# Altium project Fuente.V01.R00.PrjPcb
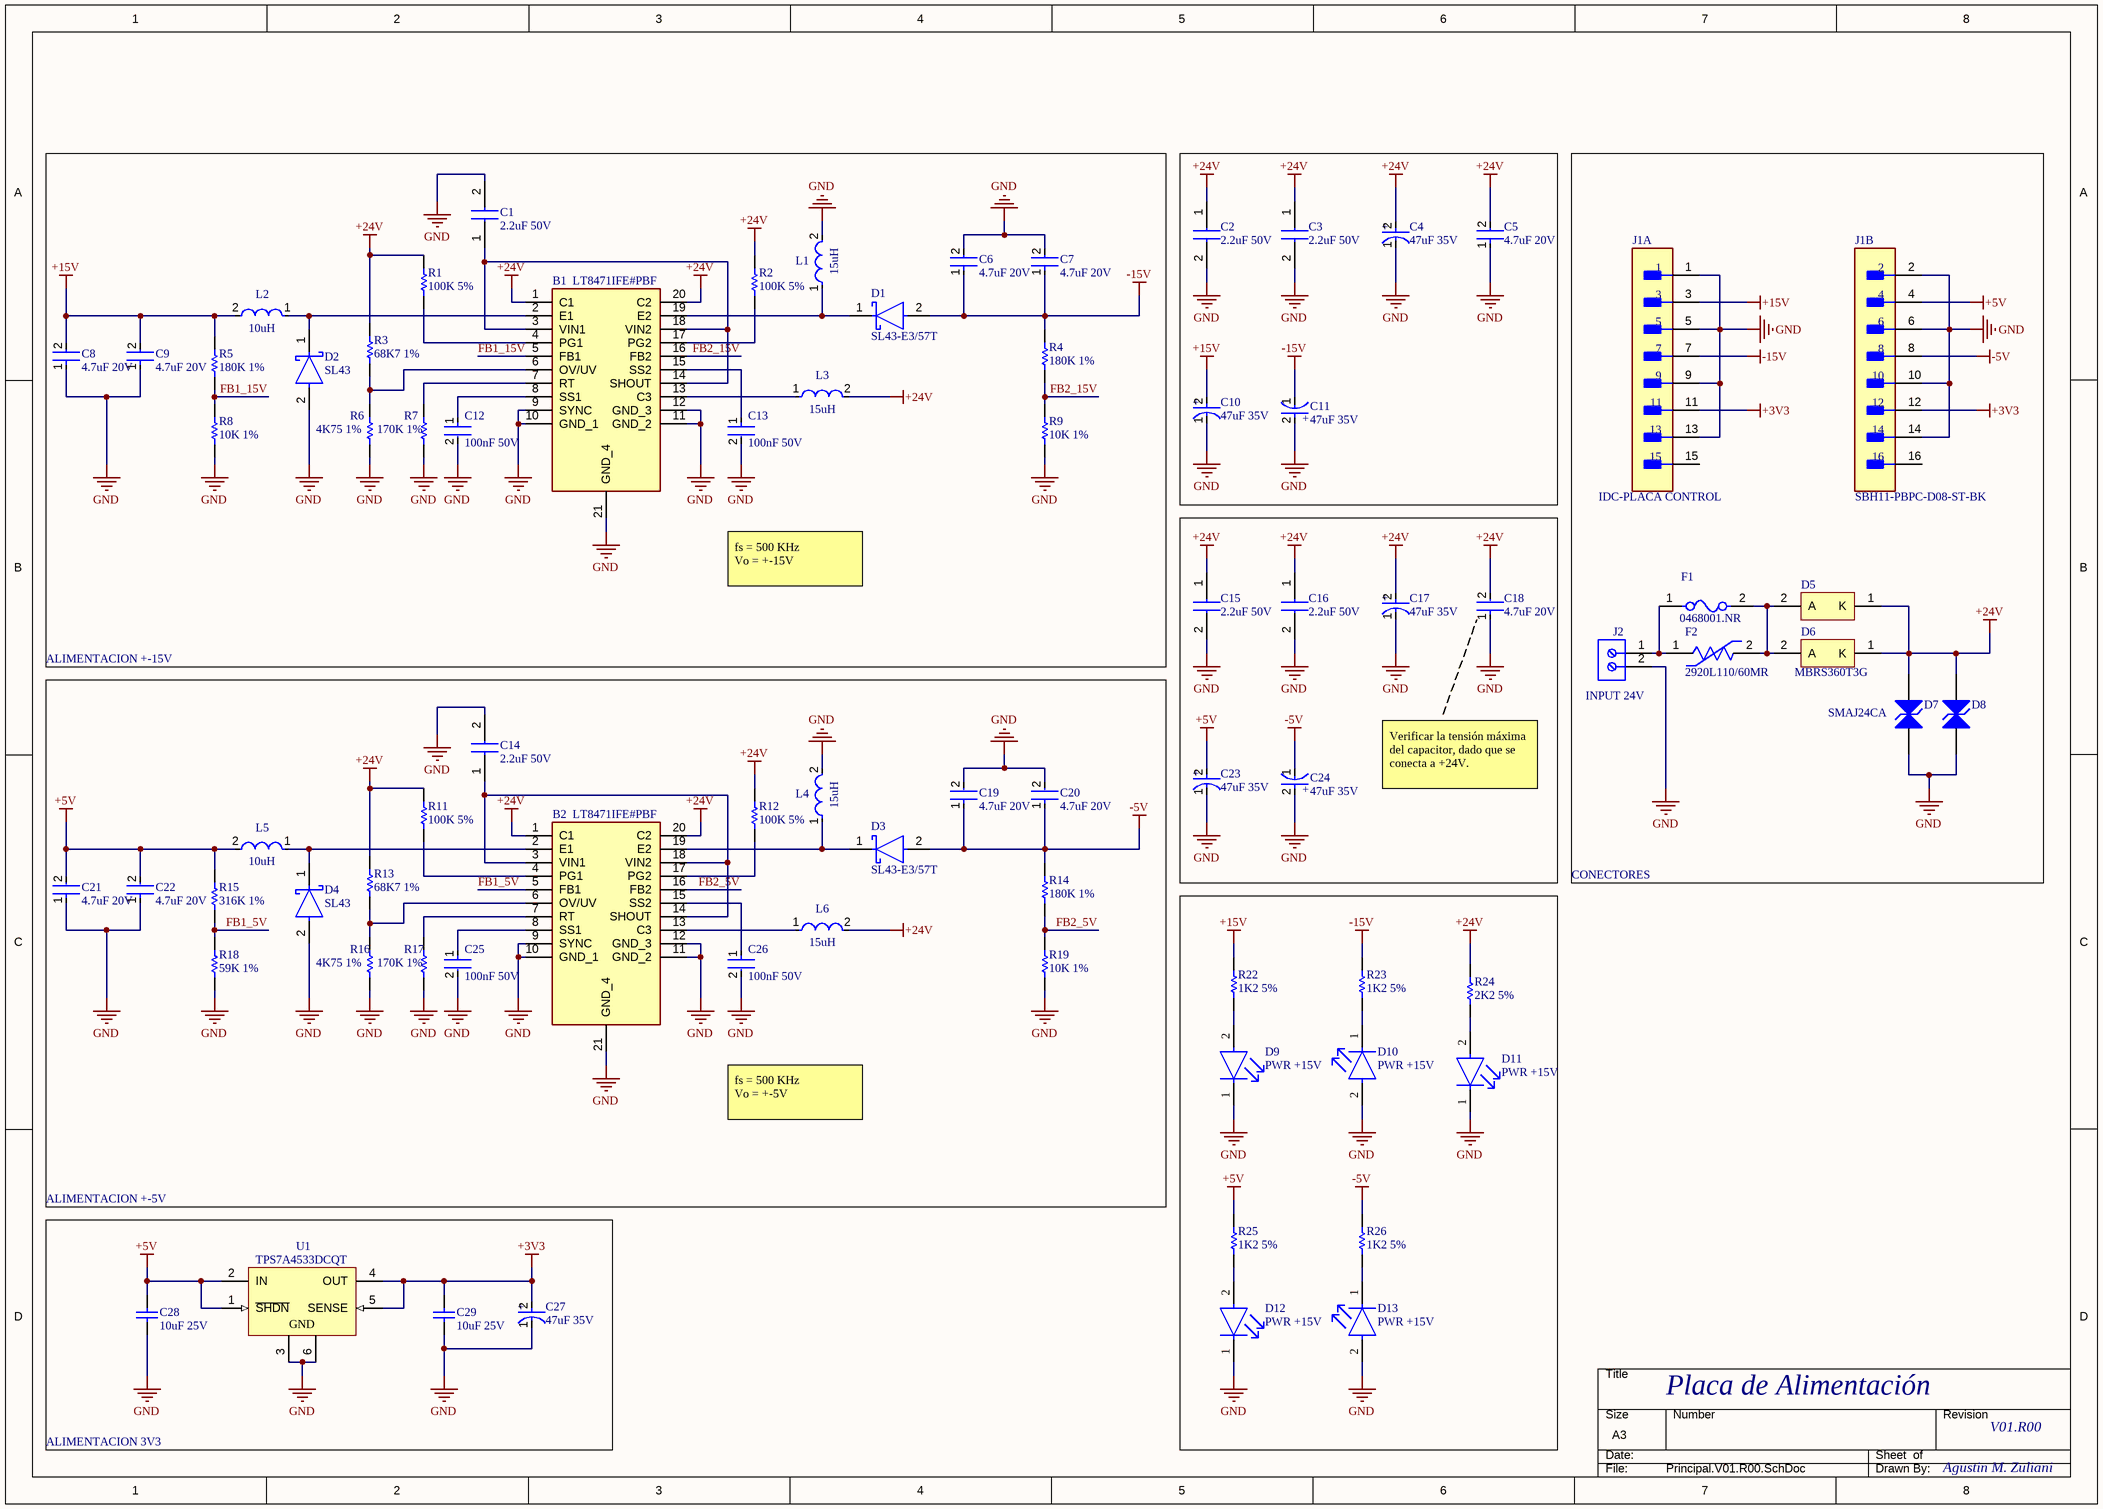
[diagram p0: Principal.V01.R00.SchDoc]
$(Librerias): D:\aguat\Documents\GitHub\AWG-RP2040\PCB\PCB_Fuente\Libreria-MouserElectronics
1 sheet, 78 parts. Net scope: global (net labels, ports and power ports of the same name join across sheets).
Board file: PCB-Fuente.V01.R00.PcbDoc

## Sheet Principal.V01.R00.SchDoc: Placa de Alimentación
size A3; Author: Agustin M. Zuliani; DrawnBy: Agustin M. Zuliani; Revision: V01.R00; SheetNumber: 1; SheetTotal: 1

### Parts
B1  LT8471IFE#PBF  [SOP65P640X120-21N]
B2  LT8471IFE#PBF  [SOP65P640X120-21N]
C1  2.2uF 50V  [MBASx31x]
C2  2.2uF 50V  [MBASx31x]
C3  2.2uF 50V  [MBASx31x]
C4  47uF 35V  [FP-FK-D-MFG]
C5  4.7uF 20V  [FP-CC1206-1_25-MFG]
C6  4.7uF 20V  [FP-CC1206-1_25-MFG]
C7  4.7uF 20V  [FP-CC1206-1_25-MFG]
C8  4.7uF 20V  [FP-CC1206-1_25-MFG]
C9  4.7uF 20V  [FP-CC1206-1_25-MFG]
C10  47uF 35V  [FP-FK-D-MFG]
C11  47uF 35V  [FP-FK-D-MFG]
C12  100nF 50V  [FP-C1206C-EB-MFG]
C13  100nF 50V  [FP-C1206C-EB-MFG]
C14  2.2uF 50V  [MBASx31x]
C15  2.2uF 50V  [MBASx31x]
C16  2.2uF 50V  [MBASx31x]
C17  47uF 35V  [FP-FK-D-MFG]
C18  4.7uF 20V  [FP-CC1206-1_25-MFG]
C19  4.7uF 20V  [FP-CC1206-1_25-MFG]
C20  4.7uF 20V  [FP-CC1206-1_25-MFG]
C21  4.7uF 20V  [FP-CC1206-1_25-MFG]
C22  4.7uF 20V  [FP-CC1206-1_25-MFG]
C23  47uF 35V  [FP-FK-D-MFG]
C24  47uF 35V  [FP-FK-D-MFG]
C25  100nF 50V  [FP-C1206C-EB-MFG]
C26  100nF 50V  [FP-C1206C-EB-MFG]
C27  47uF 35V  [FP-FK-D-MFG]
C28  10uF 25V  [CAPC1812(4532)280_L]
C29  10uF 25V  [CAPC1812(4532)280_L]
D1  SL43-E3/57T  [FP-95402-MFG]
D2  SL43  [FP-95402-MFG]
D3  SL43-E3/57T  [FP-95402-MFG]
D4  SL43  [FP-95402-MFG]
D5  MBRS360T3G  [ONSC-SMC-2-403-03_V]  (value not drawn)
D6  MBRS360T3G  [ONSC-SMC-2-403-03_V]
D7  SMAJ24CA  [VISH-DO-214AC-2_N]  (value not drawn)
D8  SMAJ24CA  [VISH-DO-214AC-2_N]
D9  PWR +15V  [FP-SML-LX0805UWC-TR-MFG]
D10  PWR +15V  [FP-SML-LX0805UWC-TR-MFG]
D11  PWR +15V  [FP-SML-LX0805UWC-TR-MFG]
D12  PWR +15V  [FP-SML-LX0805UWC-TR-MFG]
D13  PWR +15V  [FP-SML-LX0805UWC-TR-MFG]
F1  0468001.NR  [FP-0468-MFG]
F2  2920L110/60MR  [FP-2920L-MFG]
J1  IDC-PLACA CONTROL  [FP-SBH11-PBPC-D08-ST-BK-MFG]  (parts A,B of 2)
J2  INPUT 24V  [691111710002]
L1  15uH  [FP-NR6045-MFG]
L2  10uH  [FP-NR10050-MFG]
L3  15uH  [FP-NR6045-MFG]
L4  15uH  [FP-NR6045-MFG]
L5  10uH  [FP-NR10050-MFG]
L6  15uH  [FP-NR6045-MFG]
R1  100K 5%  [RESC0805(2012)_M]
R2  100K 5%  [RESC0805(2012)_M]
R3  68K7 1%  [RESC0805(2012)_M]
R4  180K 1%  [RESC0805(2012)_M]
R5  180K 1%  [RESC0805(2012)_M]
R6  4K75 1%  [RESC0805(2012)_M]
R7  170K 1%  [RESC0805(2012)_M]
R8  10K 1%  [RESC0805(2012)_M]
R9  10K 1%  [RESC0805(2012)_M]
R11  100K 5%  [RESC0805(2012)_M]
R12  100K 5%  [RESC0805(2012)_M]
R13  68K7 1%  [RESC0805(2012)_M]
R14  180K 1%  [RESC0805(2012)_M]
R15  316K 1%  [RESC0805(2012)_M]
R16  4K75 1%  [RESC0805(2012)_M]
R17  170K 1%  [RESC0805(2012)_M]
R18  59K 1%  [RESC0805(2012)_M]
R19  10K 1%  [RESC0805(2012)_M]
R22  1K2 5%  [RESC0805(2012)_M]
R23  1K2 5%  [RESC0805(2012)_M]
R24  2K2 5%  [RESC0805(2012)_M]
R25  1K2 5%  [RESC0805(2012)_M]
R26  1K2 5%  [RESC0805(2012)_M]
U1  TPS7A4533DCQT  [DCQ0006A_M]

### Blocks framed on the sheet
ALIMENTACION +-15V: B1 C1 C6-C9 C12 C13 D1 D2 L1-L3 R1-R9
CONECTORES: D5-D8 F1 F2 J1 J2
ALIMENTACION +-5V: B2 C14 C19-C22 C25 C26 D3 D4 L4-L6 R11-R19

### Nets
+3V3: C27.2(A) C29.2 J1.11 J1.12 U1.4(OUT) U1.5(SENSE)
+5V: C21.2 C22.2 C23.2(A) C28.2 J1.4 L5.2 R15.2 R25.1 U1.1(~{SHDN}) U1.2(IN)
+15V: C8.2 C9.2 C10.2(A) J1.3 L2.2 R5.2 R22.1
+24V: B1.1(C1) B1.20(C2) B2.1(C1) B2.20(C2) C2.1 C3.1 C4.2(A) C5.2 C15.1 C16.1 C17.2(A) C18.2 D5.1(K) D6.1(K) D7.2(A2) D8.2(A2) L3.2 L6.2 R1.2 R2.1 R3.2 R11.2 R12.1 R13.2 R24.1
-5V: C19.1 C20.1 C24.1(C) D3.2(A) J1.8 R14.2 R26.1
-15V: C6.1 C7.1 C11.1(C) D1.2(A) J1.7 R4.2 R23.1
GND: B1.9(SYNC) B1.10(GND_1) B1.11(GND_2) B1.12(GND_3) B1.21(GND_4) B2.9(SYNC) B2.10(GND_1) B2.11(GND_2) B2.12(GND_3) B2.21(GND_4) C1.2 C2.2 C3.2 C4.1(C) C5.1 C6.2 C7.2 C8.1 C9.1 C10.1(C) C11.2(A) C12.2 C13.2 C14.2 C15.2 C16.2 C17.1(C) C18.1 C19.2 C20.2 C21.1 C22.1 C23.1(C) C24.2(A) C25.2 C26.2 C27.1(C) C28.1 C29.1 D2.2(A) D4.2(A) D7.1(A1) D8.1(A1) D9.1(C) D10.2(A) D11.1(C) D12.1(C) D13.2(A) J1.1 J1.2 J1.5 J1.6 J1.9 J1.10 J1.13 J1.14 J2.2 L1.2 L4.2 R6.1 R7.1 R8.1 R9.1 R16.1 R17.1 R18.1 R19.1 U1.3(GND) U1.6(GND)
FB1_5V: B2.5(FB1) R15.1 R18.2
FB1_15V: B1.5(FB1) R5.1 R8.2
FB2_5V: B2.16(FB2) R14.1 R19.2
FB2_15V: B1.16(FB2) R4.1 R9.2
NetB1_2: B1.2(E1) D2.1(C) L2.1
NetB1_3: B1.3(VIN1) B1.14(SHOUT) B1.18(VIN2) C1.1
NetB1_4: B1.4(PG1) R1.1
NetB1_6: B1.6(OV/UV) R3.1 R6.2
NetB1_7: B1.7(RT) R7.2
NetB1_8: B1.8(SS1) C12.1
NetB1_13: B1.13(C3) L3.1
NetB1_15: B1.15(SS2) C13.1
NetB1_17: B1.17(PG2) R2.2
NetB1_19: B1.19(E2) D1.1(C) L1.1
NetB2_2: B2.2(E1) D4.1(C) L5.1
NetB2_3: B2.3(VIN1) B2.14(SHOUT) B2.18(VIN2) C14.1
NetB2_4: B2.4(PG1) R11.1
NetB2_6: B2.6(OV/UV) R13.1 R16.2
NetB2_7: B2.7(RT) R17.2
NetB2_8: B2.8(SS1) C25.1
NetB2_13: B2.13(C3) L6.1
NetB2_15: B2.15(SS2) C26.1
NetB2_17: B2.17(PG2) R12.2
NetB2_19: B2.19(E2) D3.1(C) L4.1
NetD5_2: D5.2(A) D6.2(A) F1.2 F2.2
NetD9_2: D9.2(A) R22.2
NetD10_1: D10.1(C) R23.2
NetD11_2: D11.2(A) R24.2
NetD12_2: D12.2(A) R25.2
NetD13_1: D13.1(C) R26.2
NetF1_1: F1.1 F2.1 J2.1

Not connected (* = marked no-connect by the designer): J1 15 16

### Notes on the sheet
- fs = 500 KHz
  Vo = +-15V
- Verificar la tensión máxima del capacitor, dado que se conecta a +24V.
- fs = 500 KHz
  Vo = +-5V
- ALIMENTACION 3V3
- DWG. NO.
- REV.
- SHT.
- REVISION
- DESCRIPTION
- DATE
- APPROVED
- THIS DOCUMENT AND THE DATA DISCLOSED HEREIN OR HEREWITH IS THE PROPERTY OF ALTIUM LIMITED AND MAY BE FREELY DISTRIBUTED IN WHOLE. NO RIGHTS ARE RESERVED OR EXPRESS OR IMPLIED WARANTEE GIVEN.
- ENG:
- DSN:
- APPROVALS
- PROJECT
- DOCUMENT REVISION:
- DESIGN ITEM:
- CHK:
- BOM:
- REFERENCE DOCUMENTS
- PROJECT REVISION:
- TITLE
- FAB DWG:
- PCB DWG:
- ASSY DWG:
- SCALE:
- SIZE
- C
- CAGE CODE
- FILE NAME
- DWG NO.
- SHEET
- OF
- REV
- (in symbol CMP-05427-000002-1) +

### Library data of the parts
B1 B2 = LT8471IFE#PBF: DC/DC CONVERTER, MULTITOPOLOGY, 50V, TSSOP-20; Supply Voltage:50V; No. of Step-Down DC - DC Converters:2; No. of LDO Regulators:-; No. of Regulated Outputs:2; Digital IC Case:TSSOP; No. of Pins:20Pins; Operating Temperature Min:-40CRoHS Compliant: Yes; Manufacturer_Name: Analog Devices; Geometry.Height: 1.2mm; Mouser Part Number: 584-LT8471IFE#PBF; Mouser Price/Stock: https://www.mouser.co.uk/ProductDetail/Analog-Devices/LT8471IFEPBF?qs=hVkxg5c3xu%2FiDctk9AXMtQ%3D%3D; Manufacturer_Part_Number: LT8471IFE#PBF; Datasheet Link: https://www.analog.com/media/en/technical-documentation/data-sheets/8471fd.pdf
C1-C3 C14-C16 = MBASU31LSB7225KTNA01: Capacitor; Manufacturer_Name: TAIYO YUDEN; Datasheet Link: https://ds.yuden.co.jp/TYCOMPAS/or/detail?pn=MBASU31LSB7225KTNA01; Height: 1.6mm; Manufacturer_Part_Number: MBASU31LSB7225KTNA01
C4 C10 C11 C17 C23 C24 C27 = CMP-05427-000002-1: CAP ALUM 47UF 20% 35V SMD; Manufacturer: Panasonic; Manufacturer Part Number: EEE-FK1V470P; Life: 2000Hours; Leakage Current: 16.45uA; Automotive Grade: Grade 2; Esr: 0.36Ω; Ripple Current: 240mA; Material: Aluminum; Dissipation Factor: 12%; Category: Cap; Device Class L3: Aluminum Electrolytic Capacitors; Value: 47uF; Device Class L2: Capacitors; ComponentLink2Description: Datasheet; Capacitance: 47uF; Temperature Range Low: -55°C; Device Class L1: Passive Components; Height: 6.1mm; Temperature Range High: +105°C; Lead Free: Yes; Octopart: https://octopart.com/eeefk1v470p-panasonic-4642848; Tolerance: 20%; Temperature: -55°C to +105°C; Voltage Rating: 35V; ComponentLink2URL: https://industrial.panasonic.com/cdbs/www-data/pdf/RDE0000/ABA0000C1181.pdf; Automotive: Yes; Mouser Description: Capacitor Aluminum Electrolytic 47uF 35 Volt 20% (6.3 X 5.8mm) Surface Mount 240mA 2000h 105C Automotive; RoHS: TRUE; Digikey Description: CAP ALUM 47UF 20% 35V SMD; Package: FK-D
C5-C9 C18-C22 = CMP-03422-001171-1: CAP CER 1UF 10V X7R 1206; Manufacturer: Yageo; Manufacturer Part Number: CC1206KKX7R6BB105; Material: Ceramic; Tolerance: 0.1; Automotive Grade: NA; Temperature Coefficient: 15%; Category: Cap; Package: CC1206-1.25; Device Class L3: Ceramic Capacitors; Footprint Url: http://www.yageo.com/exep/pages/download/literatures/UPY-C_GEN_24.pdf; Octopart: https://octopart.com/cc1206kkx7r6bb105-yageo-21769912; Temperature Range High: +125°C; Lead Free: Yes; Capacitance: 1 uF; Voltage Rating: 10 V; ComponentLink2Description: Datasheet; ComponentLink2URL: http://www.yageo.com/documents/recent/UPY-NP0X7R_HV_1KV-to-3KV_11.pdf; Height: 1.45mm; Device Class L1: Passive Components; Temperature Range Low: -55°C; Value: 1 uF; Device Class L2: Capacitors; Digikey Description: CAP CER 1UF 10V X7R 1206; RoHS: TRUE; Mouser Description: Multilayer Ceramic Capacitors MLCC - SMD/SMT 1.0uF 10V X7R 10%; Temperature Characteristic: X7R; Automotive: No; Temperature: -55°C to +125°C
C12 C13 C25 C26 = CMP-03020-005759-1: CAP CER 0.1UF 50V X7R 1206; Manufacturer: KEMET; Manufacturer Part Number: C1206C104K5RACAUTO; Capacitance: 0.10 μF; Temperature Coefficient: 15%; Value: 0.10 μF; Material: Ceramic; Automotive Grade: Grade 0; Tolerance: 0.1; RoHS: TRUE; Lead Free: Yes; ComponentLink2Description: Datasheet; Automotive: Yes; Temperature Characteristic: X7R; Temperature Range Low: -55°C; Voltage Rating: 50 V; Device Class L1: Passive Components; Ipc Land Pattern Name: CAPC320160X78; Mouser Description: Multilayer Ceramic Capacitors MLCC - SMD/SMT 0.1uF 50volts 10% X7R AUTO; Octopart: https://octopart.com/c1206c104k5racauto-kemet-12595586; Device Class L3: Ceramic Capacitors; Digikey Description: CAP CER 0.1UF 50V X7R 1206; Temperature Range High: +150°C; Temperature: -55°C to +150°C; Device Class L2: Capacitors; ComponentLink2URL: https://content.kemet.com/datasheets/KEM_C1007_X8R_ULTRA_150C_SMD.pdf; Package: C1206C-EB; Category: Cap; Height: 0.88mm
C28 C29 = CMP-1040-01657-2: CAP 10uF 25V ±20% 1812 (4532 Metric) Thickness 2.8mm SMD; Tolerance: Â±20%; Case-EIA: 1812; Case-Metric: 4532; Max Thickness: 2.8 mm; Technology: SMT; Value: 10uF; Rated Voltage: 25 V
D1-D4 = CMP-02539-000070-1: DIODE SCHOTTKY 30V 4A DO214AB; Polarity: Standard; Max Forward Surge Current (Ifsm): 150A; Forward Current: 8A; Forward Voltage: 470mV; Max Reverse Current: 500uA; Element Configuration: Single; Height: 0.095inch; Case/Package: DO-214AB; Voltage Rating (DC): 30V; Output Current: 4A; Length: 0.279inch; Mount: Surface Mount; Min Operating Temperature: -55°C; Packaging: Tape and Reel; Package Quantity: 1; Peak Non-Repetitive Surge Current: 150A; Average Rectified Current: 4A; Current Rating: 4A; Number of Pins: 2; Width: 0.245inch; Lead Free: Lead Free; Max Operating Temperature: 125°C; Max Reverse Voltage (DC): 30V; Max Repetitive Reverse Voltage (Vrrm): 30V
D5 D6 = CMP-1055-00394-1: Schottky Power Rectifier, 2-Pin SMC, Pb-Free, Tape and Reel; Manufacturer: On Semiconductor; Configuration: Single; IFSM Max (A): 125; Packing: Tape and Reel; DatasheetVersion: Rev. 8; PackageReference: SMC-2-403-03; Mounting Technology: Surface Mount; ComponentLink2Description: Datasheet; ComponentLink2URL: http://www.onsemi.cn/pub_link/Collateral/MBRS360T3-D.PDF; PartNumber: MBRS360T3G; ComponentLink1Description: Manufacturer URL; ComponentLink3Description: Package Specification; PackageDescription: 2-Pin Small Molded Package, J-Bend Lead, Body 5.845 x 6.855 mm; ComponentLink1URL: http://www.onsemi.com/; PackageVersion: Rev. E, 08/2005; RoHS: TRUE; ComponentLink3URL: http://www.onsemi.com/pub_link/Collateral/403-03.PDF
D7 D8 = CMP-0548-00269-2: Transient Voltage Suppressor, 6.40 to 231 V, 24 V Stand-off Voltage, Bi-Directional, -55 to 155 degC, 2-pin DO-214AC, Pb-Free, Tape and Reel; Manufacturer: Vishay Semiconductor; PartNumber: SMAJ24CA-E3/5A; VBR Bi-Directional (V): 6.4 to 231; IFSM: 40 A; VWM (V): 24; PPPM (W): 400, 300; ID (uA): 2; Mounting Technology: Surface Mount; PackageReference: DO-214AC-2; ComponentLink1URL: http://www.vishay.com/; ComponentLink2Description: Datasheet; Operating Junction and Storage Temperature Range: -55 to 150 degC; RoHS: TRUE; ComponentLink2URL: http://www.vishay.com/docs/88390/smaj50a.pdf; ComponentLink3Description: Package Specification; PackageDescription: 2-Pin DO-214AC (SMA), Body 4.245 x 2.665 mm; DatasheetVersion: 12/8/2013; ComponentLink3URL: http://www.vishay.com/docs/88390/smaj50a.pdf; Packing: Tape and Reel; ComponentLink1Description: Manufacturer URL
D9-D13 = CMP-00229-00139794-1: SML-LX0805UWC-TR White LED, 0805 Diffused, Rectangle Lens SMD package; NexarPartId: 139794; Approvals: CSA, UL; Lens Color: Clear, Yellow; Luminous Intensity: 150mcd; Power Rating: 120mW; Forward Current: 20mA; Forward Voltage: 3.5V; Number of LEDs: 1; Viewing Angle: 120°; RoHS: Compliant; Case/Package: 0805; Illumination Color: White; Min Operating Temperature: -40°C; Mount: Surface Mount; Max Operating Temperature: 85°C
F1 = CMP-2000-05753-2: FUSE BOARD MNT 1A 63VAC/VDC 1206; Manufacturer: Littelfuse; Fuse Interrupt Dc Current: 50A; Fuse I2T: 0.127A2Sec; Max Fuse Ac Voltage: 63V; Fuse Blow Speed: Slow; Resistance: 0.079Ω; Value: 0.079Ω; Fuse Voltage Drop: 94.7mV; Temperature: -55°C to +90°C; Automotive: No; Height: 0.762mm; Octopart: https://octopart.com/0468001.nr-littelfuse-566477; Device Class L1: Circuit Protection; Digikey Description: FUSE BOARD MNT 1A 63VAC/VDC 1206; ComponentLink2Description: Datasheet; Temperature Range Low: -55°C; Mouser Description: Surface Mount Fuses 1A Slo-Blo; Fuse Interrupt Ac Current: 50A; Max Fuse Dc Voltage: 63V; Fuse Current: 1A; RoHS: TRUE; Temperature Range High: +90°C; Category: Fuse; ComponentLink2URL: https://m.littelfuse.com/~/media/electronics/datasheets/fuses/littelfuse_fuse_468_datasheet.pdf.pdf; Package: 0468; Device Class L3: unset; Voltage Rating: 63V; Device Class L2: Fuses; Manufacturer Part Number: 0468001.NR; Lead Free: Yes
F2 = CMP-08606-000028-1: PTC RESET FUSE 60V 1.1A 2920; Manufacturer: Littelfuse; Value: 0.12-0.41Ω; Trip Time: 0.5s; Current Rating: 20A; Trip Current: 2.2A; Category: Fuse; Temperature: -40°C to +85°C; ComponentLink2Description: Datasheet; Lead Free: Yes; Temperature Range Low: -40°C; ComponentLink2URL: https://m.littelfuse.com/~/media/electronics/datasheets/resettable_ptcs/littelfuse_ptc_2920l_datasheet.pdf.pdf; Height: 2mm; Manufacturer Part Number: 2920L110/60MR; Temperature Range High: +85°C; Automotive: No; Digikey Description: PTC RESET FUSE 60V 1.1A 2920; Device Class L3: unset; RoHS: TRUE; Device Class L2: PTC Resettable Fuses; Voltage Rating: 60V; Octopart: https://octopart.com/2920l110%2F60mr-littelfuse-75250824; Device Class L1: Circuit Protection; Package: 2920L; Hold Current: 1.1A; Ambient Temperature Range High: +85°C; Resistance: 0.12-0.41Ω; Ambient Temperature Range Low: -40°C
J1 = CMP-25680-000019-1: CONN HEADER VERT 16POS 2.54MM; Manufacturer: Sullins; Manufacturer Part Number: SBH11-PBPC-D08-ST-BK; Current Rating: 3A; Conn Gender: Male; Conn Orientation: Straight; Standoff Height: 0.3mm; Number Of Contacts: 16; Temperature: -40°C to +105°C; Digikey Description: CONN HEADER VERT 16POS 2.54MM; Contact Material: Gold,Nickel; Temperature Range High: +105°C; Package: 0; Octopart: https://octopart.com/sbh11-pbpc-d08-st-bk-sullins-12270491; Category: Conn; Automotive: No; Lead Free: Yes; ComponentLink2Description: Datasheet; Device Class L1: Connectors; Number Of Rows: 2; ComponentLink2URL: https://drawings-pdf.s3.amazonaws.com/11091.pdf; RoHS: TRUE; Height: 9.3mm; Pitch: 2.54mm; Temperature Range Low: -40°C; Device Class L2: Headers and Wire Housings; Device Class L3: unset
J2 = CMP-1502-03262-3: 111 Series 5MM Pitch Straight, Pcb Terminal Block, Through Hole, 2 Way; Voltage Rating: 300V; Stripping Length: -6mm; Number of Positions Per Level: 2; Current Rating: 8A; Number of Levels: 1; Wire/Cable Gauge: 26AWG; Pitch: 5.0038mm; Housing Material: Nylon; RoHS: Compliant; Lead Pitch: 5mm; Height: 14mm; Contact Material: Brass; Termination: Screw; Color: Green; Case/Package: J; Number of Contacts: 2; Packaging: Box; Width: 11.2mm; Contact Plating: Tin; Length: 7.6mm; Number of Pins: 2; Max Operating Temperature: 105°C; REACH SVHC: Unknown; Min Operating Temperature: -40°C
L1 L3 L4 L6 = CMP-14484-001063-1: Shielded Wirewound Inductor 15uH 20% 2.3A 91mΩ SMD; Core Material: Ferrite; Saturation Current: 2.5A; RMS Current (Irms): 1.9A; Self Resonant Frequency: 10MHz; DC Resistance (DCR): 91mR; Test Frequency: 100kHz; Tolerance: 20%; Case/Package: 6045; Halogen Free: Halogen Free; Package Quantity: 1500; Radiation Hardening: No; Current Rating: 1.9A; Inductance: 15uH; Resistor Type: Wirewound; Min Operating Temperature: -25°C; Number of Pins: 2; Height: 4.5mm; Packaging: Tape and Reel; Length: 6mm; Depth: 6.2mm; Mount: Surface Mount; Inductance Tolerance: 20%; RoHS Compliant: Yes; Max Operating Temperature: 125°C; Max DC Current: 1.9A; Shielding: Shielded; Height - Seated (Max): 0.177inch; Termination: SMD/SMT; Lead Free: Lead Free; Width: 6mm; Series: NRS; Lead Pitch: 4.7mm
L2 L5 = CMP-14484-000424-1: Inductor Power Shielded Wirewound 10uH 20% 100KHz Ferrite 4.1A 32.5mΩ DCR T/R; Max DC Current: 4.7A; DC Resistance (DCR): 32.5mR; Self Resonant Frequency: 15MHz; Core Material: Ferrite; Packaging: Tape and Reel; Length: 0.394inch; Width: 0.386inch; Series: NR; Inductance Tolerance: 20%; Max Operating Temperature: 105°C; RoHS Compliant: Yes; RMS Current (Irms): 4.1A; Shielding: Shielded; Resistor Type: Wirewound; Inductance: 10uH; Mount: Surface Mount; Termination: SMD/SMT; Saturation Current: 4.7A; Min Operating Temperature: -25°C; Current Rating: 4.1A; Lead Free: Lead Free; Package Quantity: 500; Height: 5mm; Test Frequency: 100kHz; Number of Pins: 2; Case/Package: Nonstandard; Halogen Free: Halogen Free; Tolerance: 20%; Height - Seated (Max): 0.197inch
R1-R9 R11-R19 R22-R26 = CMP-1013-00746-1: 124K 0.125W 1% 0805 (2012 Metric)  SMD; Case-EIA: 0805; Value: 124000.00 Ohm; Case-Metric: 2012; Technology: SMT; Power: 0.125 W; Tolerance: 1 %
U1 = CMP-0395-00359-2: Single Output Fast Transient Response LDO, 1.5 A, Fixed 3.3 V Output, 2.1 to 20 V Input, 6-pin SOT-223 (DCQ), -40 to 125 degC, Green (RoHS & no Sb/Br); Manufacturer: Texas Instruments; Iq(Typ)(mA): 1; Vin(Min)(V): 2.1; Fixed Output Options(V): 3.3; Iout(Max)(A): 1.5; SubFamily: Single Channel LDO; Vin(Max)(V): 20; Vdo(Typ)(mV): 300; ComponentLink1URL: http://www.ti.com/; PartNumber: TPS7A4533DCQT; ComponentLink3URL: http://www.ti.com/litv/pdf/mpds098c; ComponentLink2Description: Datasheet; Vout Adj(Min)(V): 3.3; ComponentLink3Description: Package Specification; Vout Adj(Max)(V): 3.3; DatasheetVersion: SLVS720D; Mounting Technology: Surface Mount; PackageDescription: 6-Pin Plastic Small Outline, Body 3.5 x 6.5 mm, Pitch 1.27 mm; Eco-Plan: Green (RoHS & no Sb/Br); ComponentLink1Description: Manufacturer URL; Accuracy(%): 1; ComponentLink2URL: http://www.ti.com/general/docs/lit/getliterature.tsp?genericPartNumber=TPS7A4533&fileType=pdf; PackageReference: DCQ0006A; PackageVersion: 4202109/D